# EAGLE design learning_zumo (EAGLE 9.6.1)
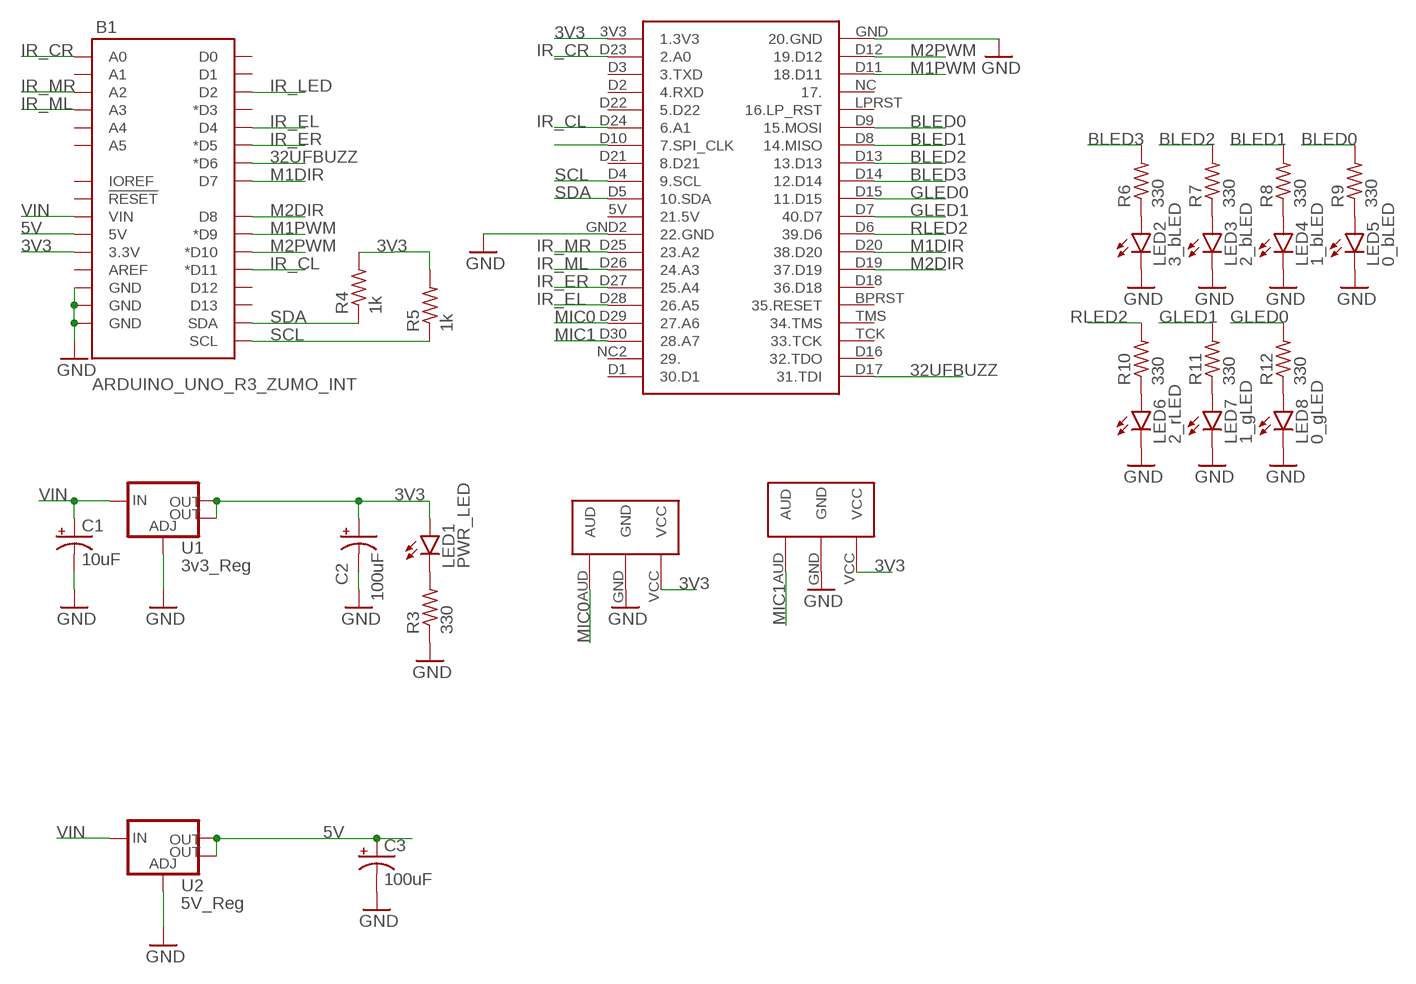
[diagram p0: schematic, sheet 1]

## Parts
B1  ARDUINO_UNO_R3_ZUMO_INT  [UNO_R3_SHIELD_ICSP]
C1  10uF  CPOL-USE2.5-5  [E2,5-5]
C2  100uF  CPOL-USE2.5-5  [E2,5-5]
C3  100uF  CPOL-USE2.5-5  [E2,5-5]
LED1  PWR_LED  LED5MM  [LED5MM]
LED2  3_bLED  LED5MM  [LED5MM]
LED3  2_bLED  LED5MM  [LED5MM]
LED4  1_bLED  LED5MM  [LED5MM]
LED5  0_bLED  LED5MM  [LED5MM]
LED6  2_rLED  LED5MM  [LED5MM]
LED7  1_gLED  LED5MM  [LED5MM]
LED8  0_gLED  LED5MM  [LED5MM]
R3  330  R-US_0207/10  [0207/10]
R4  1k  R-US_0207/10  [0207/10]
R5  1k  R-US_0207/10  [0207/10]
R6  330  R-US_0207/10  [0207/10]
R7  330  R-US_0207/10  [0207/10]
R8  330  R-US_0207/10  [0207/10]
R9  330  R-US_0207/10  [0207/10]
R10  330  R-US_0207/10  [0207/10]
R11  330  R-US_0207/10  [0207/10]
R12  330  R-US_0207/10  [0207/10]
U1  3v3_Reg  NU32V7_V_REG_LM1117SOT223  [NU32V7_SOT223]
U2  5V_Reg  NU32V7_V_REG_LM1117SOT223  [NU32V7_SOT223]
U$1  CC1310_INT  [CC1310_INT]
U$2  ANALOG_MIC  [ANALOG_MIC]
U$3  ANALOG_MIC  [ANALOG_MIC]

## Nets
3V3: B1.3.3V C2.+ LED1.A R4.2 R5.2 U1.OUTPUT(OUT) U1.VOUT(OUT) U$1.3V3(1.3V3) U$2.VCC U$3.VCC
5V: B1.5V C3.+ U2.OUTPUT(OUT) U2.VOUT(OUT)
32UFBUZZ: B1.D6(*D6) U$1.D17(31.TDI)
BLED0: R9.2 U$1.D9(15.MOSI)
BLED1: R8.2 U$1.D8(14.MISO)
BLED2: R7.2 U$1.D13(13.D13)
BLED3: R6.2 U$1.D14(12.D14)
GLED0: R12.2 U$1.D15(11.D15)
GLED1: R11.2 U$1.D7(40.D7)
GND: B1.GND@0(GND) B1.GND@1(GND) B1.GND@2(GND) C1.- C2.- C3.- LED2.K(C) LED3.K(C) LED4.K(C) LED5.K(C) LED6.K(C) LED7.K(C) LED8.K(C) R3.1 U1.GND(ADJ) U2.GND(ADJ) U$1.GND2(22.GND) U$1.GND(20.GND) U$2.GND U$3.GND
IR_CL: B1.D11(*D11) U$1.D24(6.A1)
IR_CR: B1.A0 U$1.D23(2.A0)
IR_EL: B1.D4 U$1.D28(26.A5)
IR_ER: B1.D5(*D5) U$1.D27(25.A4)
IR_LED: B1.D2
IR_ML: B1.A3 U$1.D26(24.A3)
IR_MR: B1.A2 U$1.D25(23.A2)
M1DIR: B1.D7 U$1.D20(38.D20)
M1PWM: B1.D9(*D9) U$1.D11(18.D11)
M2DIR: B1.D8 U$1.D19(37.D19)
M2PWM: B1.D10(*D10) U$1.D12(19.D12)
MIC0: U$1.D29(27.A6) U$2.AUD
MIC1: U$1.D30(28.A7) U$3.AUD
N$1: U$1.D10(7.SPI_CLK)
N$3: LED1.K(C) R3.2
N$4: LED2.A R6.1
N$5: LED3.A R7.1
N$6: LED4.A R8.1
N$7: LED5.A R9.1
N$8: LED6.A R10.1
N$9: LED7.A R11.1
N$10: LED8.A R12.1
RLED2: R10.2 U$1.D6(39.D6)
SCL: B1.SCL R5.1 U$1.D4(9.SCL)
SDA: B1.SDA R4.1 U$1.D5(10.SDA)
VIN: B1.VIN C1.+ U1.INPUT(IN) U2.INPUT(IN)
Unconnected: B1.A1 B1.A4 B1.A5 B1.AREF B1.D3(*D3) B1.D12 B1.D13 B1.IOREF B1.RES(!RESET!) B1.RX(D0) B1.TX(D1) U$1.5V(21.5V) U$1.BPRST(35.RESET) U$1.D1(30.D1) U$1.D2(4.RXD) U$1.D3(3.TXD) U$1.D16(32.TDO) U$1.D18(36.D18) U$1.D21(8.D21) U$1.D22(5.D22) U$1.LPRST(16.LP_RST) U$1.NC2(29.) U$1.NC(17.) U$1.TCK(33.TCK) U$1.TMS(34.TMS)

## Library data of the parts
B1 = Swarm:ARDUINO_UNO_R3_ZUMO_INT: Arduino R3 Shield Footprint with ICSP Header Includes pins for 6-pin (2x3) ICSP Header. Compatible with Leonardo boards that require SPI pin connections via this header. SparkFun Products: CryptoShield <https://www.sparkfun.com/products/13183> microSD Shield <https://www.sparkfun.com/products/12761> R3 Stackable Headers Kit <https://www.sparkfun.com/products/1417>
C1-C3 = Swarm:CPOL-US: POLARIZED CAPACITOR, American symbol; SPICEPREFIX: C
LED1-LED8 = Swarm:LED: LED OSRAM: - CHIPLED LG R971, LG N971, LY N971, LG Q971, LY Q971, LO R971, LY R971 LH N974, LH R974 LS Q976, LO Q976, LY Q976 LO Q996 - Hyper CHIPLED LW Q18S LB Q993, LB Q99A, LB R99A - SideLED LS A670, LO A670, LY A670, LG A670, LP A670 LB A673, LV A673, LT A673, LW A673 LH A674 LY A675 LS A676, LA A676, LO A676, LY A676, LW A676 LS A679, LY A679, LG A679 - Hyper Micro SIDELED® LS Y876, LA Y876, LO Y876, LY Y876 LT Y87S - SmartLED LW L88C, LW L88S LB L89C, LB L89S, LG L890 LS L89K, LO L89K, LY L89K LS L896, LA L896, LO L896, LY L896 - TOPLED LS T670, LO T670, LY T670, LG T670, LP T670 LSG T670, LSP T670, LSY T670, LOP T670, LYG T670 LG T671, LOG T671, LSG T671 LB T673, LV T673, LT T673, LW T673 LH T674 LS T676, LA T676, LO T676, LY T676, LB T676, LH T676, LSB T676, LW T676 LB T67C, LV T67C, LT T67C, LS T67K, LO T67K, LY T67K, LW E67C LS E67B, LA E67B, LO E67B, LY E67B, LB E67C, LV E67C, LT E67C LW T67C LS T679, LY T679, LG T679 LS T770, LO T770, LY T770, LG T770, LP T770 LB T773, LV T773, LT T773, LW T773 LH T774 LS E675, LA E675, LY E675, LS T675 LS T776, LA T776, LO T776, LY T776, LB T776 LHGB T686 LT T68C, LB T68C - Hyper Mini TOPLED® LB M676 - Mini TOPLED Santana® LG M470 LS M47K, LO M47K, LY M47K Source: http://www.osram.convergy.de LUXEON: - LUMILED® LXK2-PW12-R00, LXK2-PW12-S00, LXK2-PW14-U00, LXK2-PW14-V00 LXK2-PM12-R00, LXK2-PM12-S00, LXK2-PM14-U00 LXK2-PE12-Q00, LXK2-PE12-R00, LXK2-PE12-S00, LXK2-PE14-T00, LXK2-PE14-U00 LXK2-PB12-K00, LXK2-PB12-L00, LXK2-PB12-M00, LXK2-PB14-N00, LXK2-PB14-P00, LXK2-PB14-Q00 LXK2-PR12-L00, LXK2-PR12-M00, LXK2-PR14-Q00, LXK2-PR14-R00 LXK2-PD12-Q00, LXK2-PD12-R00, LXK2-PD12-S00 LXK2-PH12-R00, LXK2-PH12-S00 LXK2-PL12-P00, LXK2-PL12-Q00, LXK2-PL12-R00 Source: www.luxeon.com KINGBRIGHT: KA-3528ASYC Source: www.kingbright.com
R3-R12 = Swarm:R-US_: RESISTOR, American symbol; SPICEPREFIX: R
U1 U2 = Swarm:NU32V7_V_REG_LM1117: Voltage Regulator LM1117 Standard adjustable voltage regulator but in SMD form. Spark Fun Electronics SKU : COM-00595; PROD_ID: VREG-08170
U$1 = Swarm:CC1310_INT
U$2 U$3 = Swarm:ANALOG_MIC

## Board
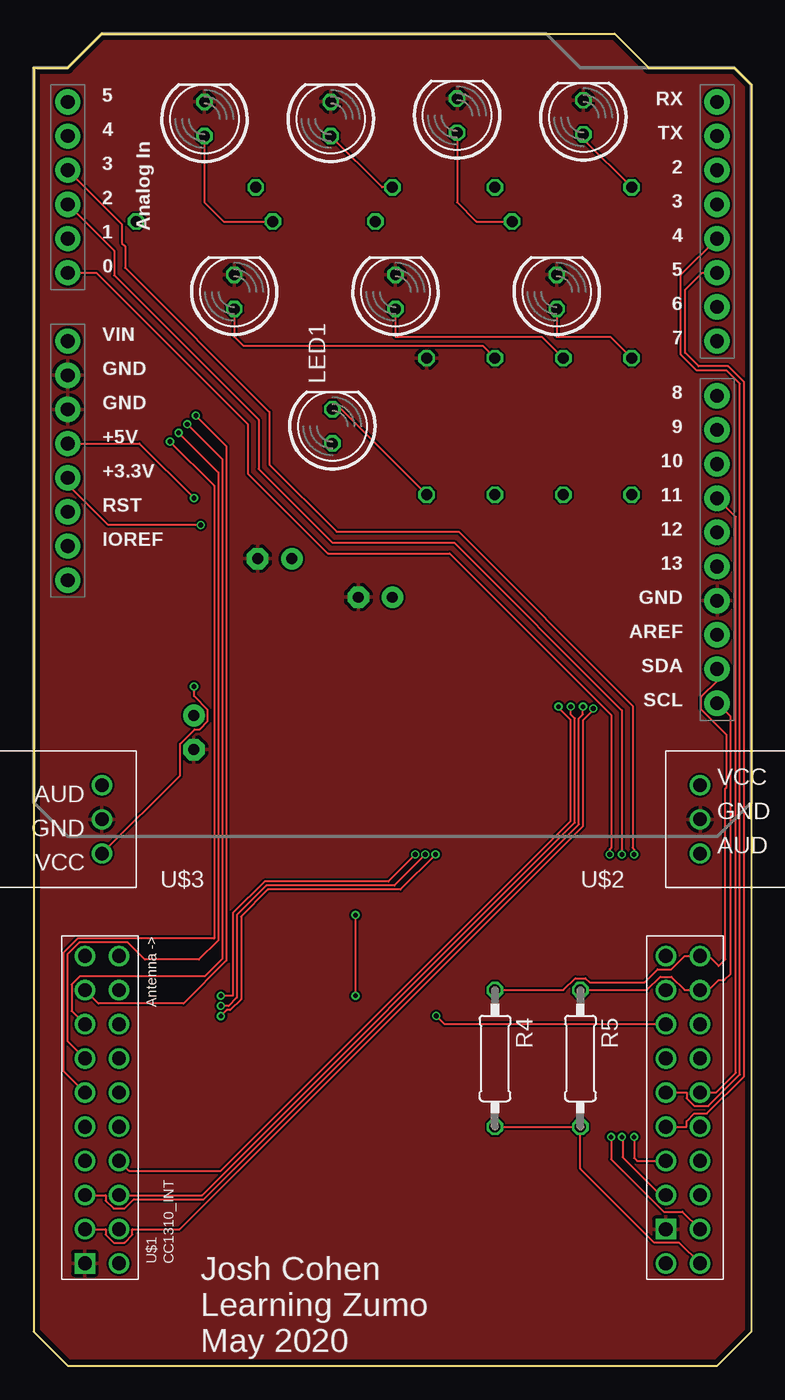
[diagram p1: board, top side]
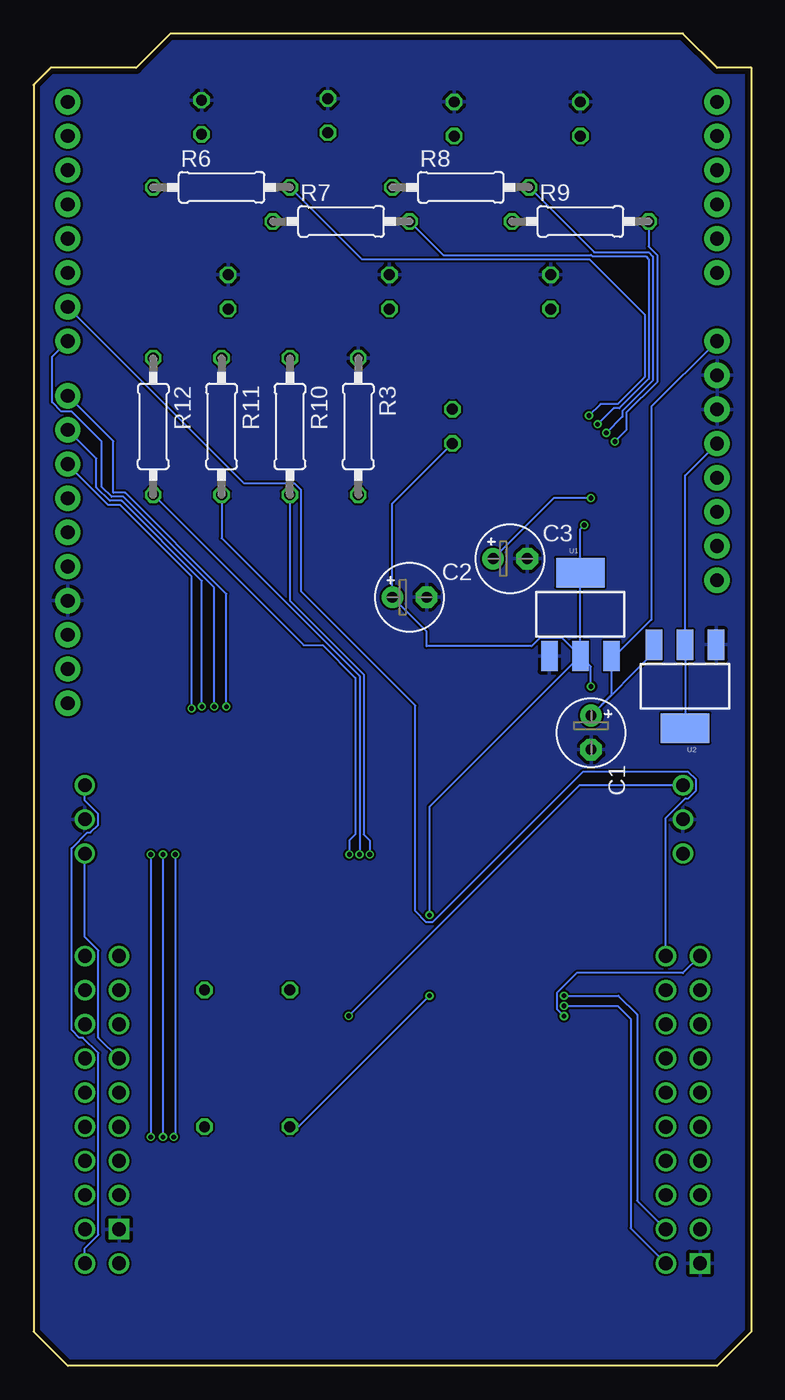
[diagram p2: board, bottom side, seen from below]

Size 53.34 x 99.06 mm. Coordinates in mm from the lower left corner, seen from the top.
Outline: 0,96.52 0,2.54 2.54,0 50.8,0 53.34,2.54 53.34,95.25 52.07,96.52 45.72,96.52 43.18,99.06 5.08,99.06 2.54,96.52 0,96.52
Copper layers (1*16): Top 0.035559375mm / dielectric 1.6mm / Bottom 0.035559375mm
Design rules "oshpark-2layer": minimum track width 6mil, minimum drill 10mil, track to track 6mil, track to pad 6mil, pad to pad 6mil, via to via 6mil, smd to smd 6mil, copper to edge 15mil, drill to drill 6mil, minimum pad ring 5mil, minimum via ring 5mil, stop-mask expansion 2.5mil, vias tented up to drill 0mil, thermal gap 10mil

### Footprints (pad centres in the part's own frame; a part is rotated, then mirrored left to right if it is on the bottom)
UNO_R3_SHIELD_ICSP = drill 1.016 pad 1.88: 3.3V -24.13,-2.54; 5V -24.13,0; A0 -24.13,12.7; A1 -24.13,15.24; A2 -24.13,17.78; A3 -24.13,20.32; A4 -24.13,22.86; A5 -24.13,25.4; AREF 24.13,-14.224; D2 24.13,20.32; D3 24.13,17.78; D4 24.13,15.24; D5 24.13,12.7; D6 24.13,10.16; D7 24.13,7.62; D8 24.13,3.556; D9 24.13,1.016; D10 24.13,-1.524; D11 24.13,-4.064; D12 24.13,-6.604; D13 24.13,-9.144; GND@0 -24.13,2.54; GND@1 -24.13,5.08; GND@2 24.13,-11.684; IOREF -24.13,-7.62; NC -24.13,-10.16; RES -24.13,-5.08; RX 24.13,25.4; SCL 24.13,-19.304; SDA 24.13,-16.764; TX 24.13,22.86; VIN -24.13,7.62
E2,5-5 = drill 0.813 pad 1.6: + -1.27,0 | drill 0.813 pad 1.6 octagon: - 1.27,0
LED5MM = drill 0.813 octagon: A -1.27,0; K 1.27,0
0207/10 = drill 0.813 octagon: 1 -5.08,0; 2 5.08,0
NU32V7_SOT223 = smd 1.219 x 2.235: GND -2.311,-3.099; INPUT 2.311,-3.099; OUTPUT 0,-3.099 | smd 3.6 x 2.2: VOUT 0,3.099
CC1310_INT = drill 1.02: 3V3 -10.16,-22.86; 5V -10.16,-20.32; BPRST 2.54,20.32; D1 12.7,-20.32; D2 -2.54,-22.86; D3 -5.08,-22.86; D4 10.16,-22.86; D5 12.7,-22.86; D6 -7.62,20.32; D7 -10.16,20.32; D8 5.08,22.86; D9 2.54,22.86; D10 5.08,-22.86; D11 -5.08,22.86; D12 -7.62,22.86; D13 7.62,22.86; D14 10.16,22.86; D15 12.7,22.86; D16 10.16,20.32; D17 12.7,20.32; D18 0,20.32; D19 -2.54,20.32; D20 -5.08,20.32; D21 7.62,-22.86; D22 0,-22.86; D23 -7.62,-22.86; D24 2.54,-22.86; D25 -5.08,-20.32; D26 -2.54,-20.32; D27 0,-20.32; D28 2.54,-20.32; D29 5.08,-20.32; D30 7.62,-20.32; LPRST 0,22.86; NC -2.54,22.86; NC2 10.16,-20.32; TCK 7.62,20.32; TMS 5.08,20.32 | drill 1.02 square: GND -10.16,22.86; GND2 -7.62,-20.32
ANALOG_MIC = drill 1: AUD 5.08,0; GND 2.54,0; VCC 0,0

### Placement (x,y rotation side)
B1  26.67,68.58 0 top
C1  11.91,47.09 270 bottom
C2  25.4,57.15 0 bottom
C3  17.92,60.02 0 bottom
LED1  22.21,69.86 90 top
LED2  40.86,92.84 90 top
LED3  31.47,92.96 90 top
LED4  22.09,92.71 90 top
LED5  12.7,92.71 90 top
LED6  14.91,79.86 90 top
LED7  26.9,79.86 90 top
LED8  38.88,79.86 90 top
R3  29.21,69.85 270 bottom
R4  34.29,22.86 270 top
R5  40.64,22.86 270 top
R6  39.37,87.63 0 bottom
R7  30.48,85.09 0 bottom
R8  21.59,87.63 0 bottom
R9  12.7,85.09 0 bottom
R10  34.29,69.85 270 bottom
R11  39.37,69.85 270 bottom
R12  44.45,69.85 270 bottom
U1  12.7,55.88 0 bottom
U2  4.92,50.52 180 bottom
U$1  26.67,17.78 90 top
U$2  49.53,43.18 270 top
U$3  5.08,38.1 90 top

### Tracks (layer width: path | path; a pad name or v marks a point on that pad's centre or on a via)
3V3  (via drill 0.35)
  Top 0.152: U$1.3V3 47.98,9.17 46.13,9.17 40.64,14.66 40.64,17.52 | 40.64,17.52 R5.2 | R4.2 40.38,17.78 40.64,17.52 | v12.42,62.52 5.56,62.52 2.54,65.54 B1.3.3V | U$3.VCC 10.88,43.9 10.88,46.25 11.97,47.33 12.34,47.33 12.94,47.93 12.94,48.79 11.92,49.81 v11.92,50.52 | v23.92,33.52 v23.92,27.52
  Bottom 0.152: LED1.A 26.67,64.13 C2.+ 24.13,54.61 24.13,53.52 16.32,53.52 15.72,54.13 14.05,54.13 U1.OUTPUT | U1.OUTPUT U1.VOUT 12.7,62.24 v12.42,62.52 | v11.92,50.52 11.92,52 U1.OUTPUT | U1.OUTPUT 23.92,41.56 v23.92,33.52 | v23.92,27.52 33.66,17.78 R4.2 | U$1.3V3 49.53,8.76 48.54,9.75 48.54,23.27 49.67,24.41 49.94,24.41 50.52,24.99 50.52,38.49 49.35,39.66 49.12,39.66 48.55,40.23 48.55,41.05 49.53,42.02 U$2.VCC
5V  (via drill 0.35)
  Top 0.152: v11.92,64.52 7.86,68.58 B1.5V
  Bottom 0.152: B1.5V 4.92,66.2 U2.OUTPUT U2.VOUT | v11.92,64.52 14.69,64.52 C3.+
32UFBUZZ
  Bottom 0.152: U$1.D17 6.35,40.75 4.9,42.2 4.68,42.2 4.1,42.78 4.1,43.59 4.68,44.16 12.53,44.16 23.7,32.99 24.14,32.99 24.97,33.82 24.97,49.1 33.45,57.58 33.45,65.12 33.94,65.61 37.67,65.61 B1.D6
BLED0  (via drill 0.35)
  Top 0.152: v10.13,68.73 13.42,65.45 13.42,31.78 3.27,31.78 2.21,30.71 2.21,21.92 U$1.D9
  Bottom 0.152: R9.2 7.62,83.22 7.01,82.61 7.01,73.14 9.27,70.87 9.27,69.59 v10.13,68.73
BLED1  (via drill 0.35)
  Top 0.152: v10.78,69.38 13.72,66.43 13.72,31.65 12.29,30.22 8.26,30.22 7,31.47 3.4,31.47 2.51,30.59 2.51,24.16 U$1.D8
  Bottom 0.152: R8.2 11.68,82.8 7.64,82.8 7.31,82.48 7.31,73.27 9.58,71 9.58,70.57 v10.78,69.38
BLED2  (via drill 0.35)
  Top 0.152: v11.42,70.02 14.03,67.41 14.03,30.27 12.73,28.97 3.43,28.97 2.82,28.35 2.82,26.39 U$1.D13
  Bottom 0.152: R7.2 22.9,82.59 11.9,82.59 11.81,82.5 7.85,82.5 7.62,82.26 7.62,73.39 9.79,71.22 10.22,71.22 v11.42,70.02
BLED3  (via drill 0.35)
  Top 0.152: v12.06,70.66 14.33,68.39 14.33,30.14 11.14,26.95 4.8,26.95 U$1.D14
  Bottom 0.152: R6.2 28.94,82.28 12.03,82.28 7.92,78.18 7.92,73.52 9.92,71.52 11.2,71.52 v12.06,70.66
GLED0  (via drill 0.35)
  Top 0.152: v29.87,38.02 27.26,35.41 17.42,35.41 15.42,33.41 15.42,27.27 14.61,26.46 14.37,26.46 v13.92,26.01
  Bottom 0.152: R12.2 33.27,53.59 31.85,53.59 29.42,51.16 29.42,39.52 29.87,39.07 v29.87,38.02 | U$1.D15 5.08,29.21 12.98,29.21 14.45,27.74 14.45,26.54 v13.92,26.01
GLED1  (via drill 0.35)
  Top 0.152: v29.12,38.02 26.81,35.72 17.29,35.72 15.12,33.54 15.12,27.39 14.49,26.76 v13.92,26.76
  Bottom 0.152: R11.2 39.37,61.54 29.12,51.28 v29.12,38.02 | v13.92,26.76 9.92,26.76 8.96,25.81 8.96,10.23 U$1.D7
GND
  pour Top: 0,96.52 2.54,96.52 5.08,99.06 44.45,99.06 49.53,99.06 50.8,97.79 54.61,93.98 54.61,46.99 54.61,2.54 48.26,-3.81 1.27,-3.81 -1.27,-1.27 -1.27,95.25
  pour Bottom: 0,96.52 3.81,100.33 55.88,100.33 55.88,55.88 55.88,0 53.34,-2.54 3.81,-2.54 -5.08,6.35 -5.08,91.44
IR_CL
  Top 0.152: U$1.D24 50.72,20.32 52.2,21.8 52.2,63.12 B1.D11
IR_CR  (via drill 0.35)
  Top 0.152: B1.A0 4.66,81.28 15.92,70.02 15.92,66.35 21.86,60.41 30.92,60.41 42.92,48.41 42.92,38.52 42.82,38.42 v42.82,38.02 | U$1.D23 48.23,11.46 46.82,11.46 42.92,15.37 v42.92,17.02
  Bottom 0.152: v42.82,38.02 42.82,17.12 v42.92,17.02
IR_EL
  Top 0.152: U$1.D28 48.54,20.32 48.54,19.91 49.12,19.33 50.16,19.33 52.5,21.67 52.5,73.02 51.5,74.02 49.29,74.02 48.12,75.2 48.12,81.14 B1.D4
IR_ER
  Top 0.152: U$1.D27 48.54,17.78 48.54,18.19 49.12,18.77 50.04,18.77 52.81,21.54 52.81,73.15 51.63,74.33 49.42,74.33 48.42,75.33 48.42,80.02 49.68,81.28 B1.D5
IR_ML  (via drill 0.35)
  Top 0.152: B1.A3 6.56,84.88 6.56,83.48 6.79,83.24 6.79,81.66 17.53,70.92 17.53,67.02 22.53,62.02 31.59,62.02 44.53,49.08 44.53,38.52 44.63,38.42 v44.63,38.02 | U$1.D26 44.86,15.24 44.63,15.47 v44.63,17.02
  Bottom 0.152: v44.63,38.02 v44.63,17.02
IR_MR  (via drill 0.35)
  Top 0.152: B1.A2 5.99,82.91 5.99,81.09 16.73,70.35 16.73,66.69 22.2,61.22 31.25,61.22 43.73,48.74 v43.73,38.02 | v43.73,17.02 43.78,16.97 43.78,15.52 46.6,12.7 U$1.D25
  Bottom 0.152: v43.73,38.02 v43.73,17.02
M1DIR  (via drill 0.35)
  Top 0.152: v39.92,49.02 39.92,48.45 40.23,48.15 40.23,40.39 12.53,12.7 U$1.D20
  Bottom 0.152: v39.92,49.02 39.92,57.89 46.67,64.63 47.55,64.63 48.28,65.36 48.28,68.73 50.52,70.97 51.28,70.97 51.97,71.65 51.97,75.03 B1.D7
M1PWM  (via drill 0.35)
  Top 0.152: U$1.D11 5.36,12.7 5.36,12.29 5.94,11.71 6.76,11.71 7.45,12.4 12.66,12.4 40.53,40.27 40.53,48.15 40.83,48.45 v40.83,49.02
  Bottom 0.152: v40.83,49.02 40.83,58.36 46.79,64.33 47.67,64.33 48.67,65.32 48.67,67.46 B1.D9
M2DIR  (via drill 0.35)
  Top 0.152: U$1.D19 7.07,14.52 13.92,14.52 39.92,40.52 39.92,48.02 39.01,48.93 v39.01,49.02
  Bottom 0.152: v39.01,49.02 39.01,57.41 46.54,64.93 47.42,64.93 47.42,68.76 B1.D8
M2PWM  (via drill 0.35)
  Top 0.152: U$1.D12 5.36,10.16 5.36,9.75 5.94,9.17 6.76,9.17 7.34,9.75 7.34,10.16 10.85,10.16 40.83,40.14 40.83,48.02 41.6,48.78 v41.6,48.88
  Bottom 0.152: v41.6,48.88 41.6,58.7 46.92,64.02 47.8,64.02 50.8,67.02 B1.D10
MIC0
  Bottom 0.152: U$1.D29 48.54,24.41 48.54,30.89 49.53,31.89 U$2.AUD
MIC1  (via drill 0.35)
  Top 0.152: U$1.D30 30.54,25.4 v29.92,26.02
  Bottom 0.152: v29.92,26.02 12.76,43.18 U$3.AUD
N$3
  Top 0.152: R3.2 22.85,71.13 LED1.K
N$4
  Top 0.152: LED2.A 40.86,91.22 R6.1
N$5
  Top 0.152: LED3.A 31.47,86.52 32.9,85.09 R7.1
N$6
  Top 0.152: LED4.A 25.9,87.63 R8.1
N$7
  Top 0.152: LED5.A 12.7,86.52 14.13,85.09 R9.1
N$8
  Top 0.152: LED6.A 14.91,76.52 15.58,75.85 33.37,75.85 R10.1
N$9
  Top 0.152: LED7.A 26.9,76.52 37.78,76.52 R11.1
N$10
  Top 0.152: LED8.A 38.88,76.52 42.86,76.52 R12.1
RLED2  (via drill 0.35)
  Top 0.152: v28.36,38.02 26.36,36.02 17.17,36.02 14.81,33.66 14.81,27.52 v13.92,27.52
  Bottom 0.152: R10.2 34.29,56.89 28.81,51.41 28.81,39.52 28.36,39.07 v28.36,38.02 | U$1.D6 8.47,12.29 8.47,26.12 9.87,27.52 v13.92,27.52
SCL
  Top 0.152: R5.1 45.59,27.94 46.58,28.93 47.4,28.93 48.4,27.94 U$1.D4 50.17,27.94 50.92,28.69 51.35,28.69 51.81,29.15 51.81,48.27 B1.SCL
SDA
  Top 0.152: R4.1 39.38,27.94 40.27,28.83 41.01,28.83 41.32,28.52 45.42,28.52 46.39,29.49 47.4,29.49 48.4,30.48 U$1.D5 50.17,30.48 50.92,29.73 51.42,30.23 51.42,42.94 51.5,43.02 51.5,46.92 49.63,48.79 49.63,49.76 50.8,50.93 B1.SDA
VIN
  Bottom 0.152: U1.INPUT 10.39,52.52 | 10.39,52.52 10.39,49.88 C1.+ 7.23,53.04 U2.INPUT | B1.VIN 7.42,71.32 7.42,55.49 10.39,52.52

### Text on the board
tPlace: Josh Cohen / Learning Zumo / May 2020